# EAGLE schematic Arduino Ibus (EAGLE 6.5.0)
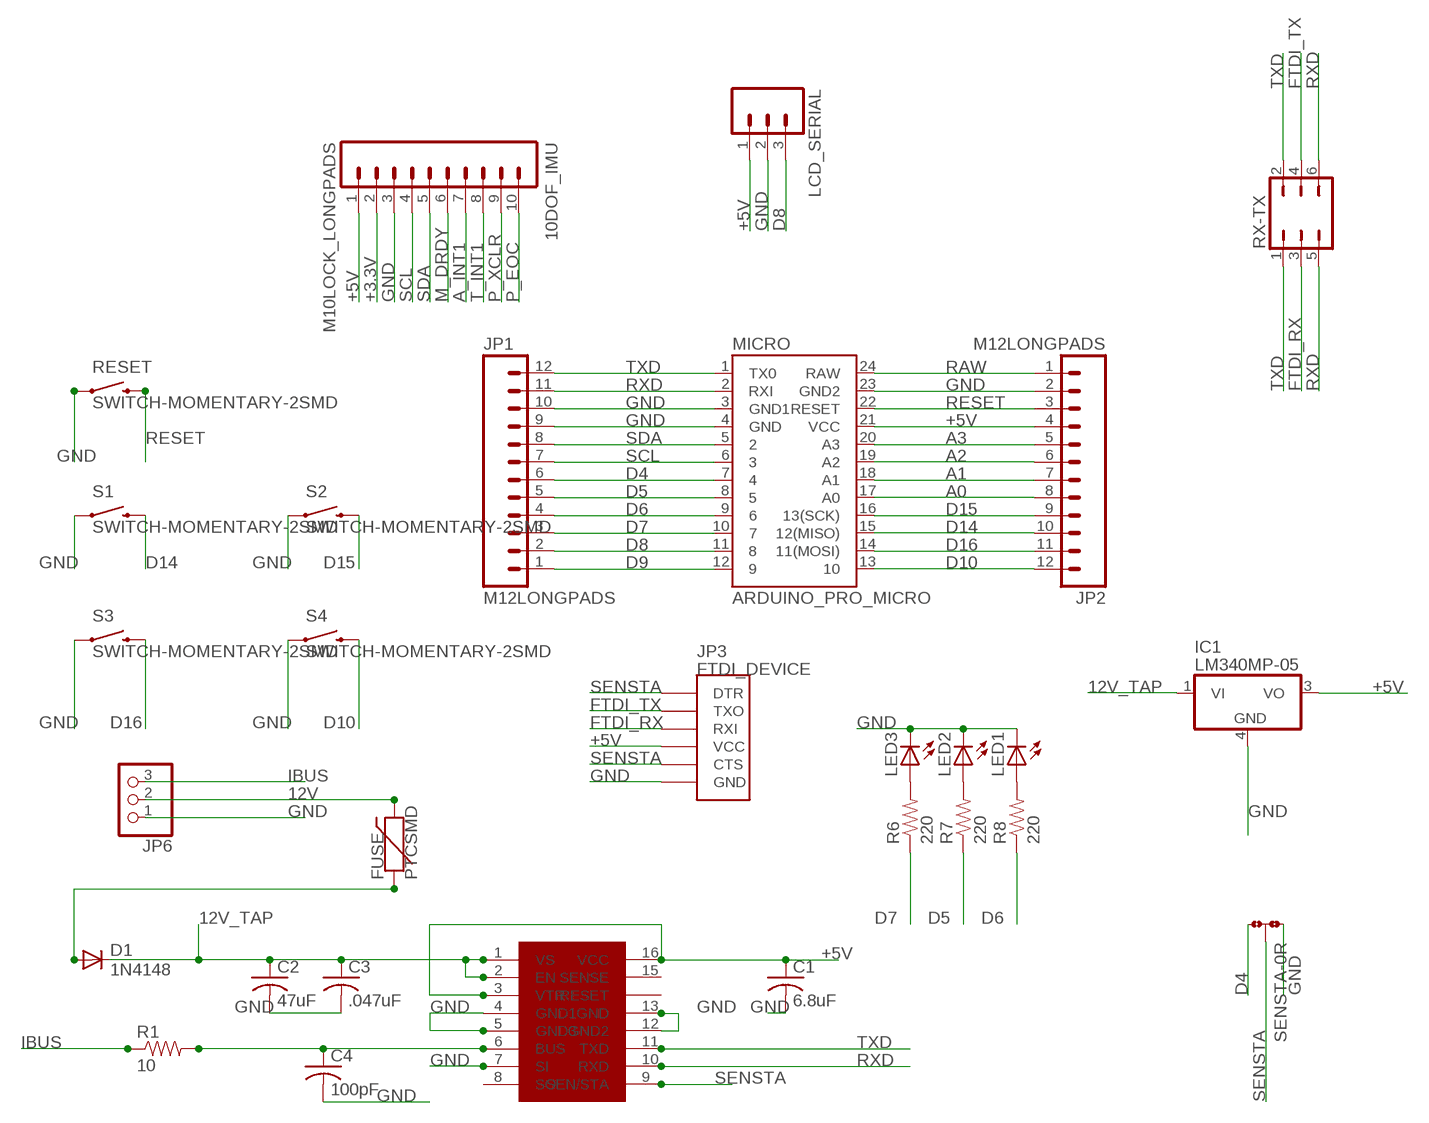
[diagram p0: schematic, sheet 1]

## Parts
10DOF_IMU  M10LOCK_LONGPADS  [1X10_LOCK_LONGPADS]
C1  6.8uF  C-USC1206  [C1206]
C2  47uF  C-USC1206  [C1206]
C3  .047uF  C-USC1206  [C1206]
C4  100pF  C-USC1206  [C1206]
D1  1N4148  DIODESMA  [SMA-DIODE]
FUSE  PTCSMD  [PTC-1206]
IC1  LM340MP-05  [SOT223]
JP1  M12LONGPADS  [1X12_LONGPADS]
JP2  M12LONGPADS  [1X12_LONGPADS]
JP3  FTDI_DEVICE  [FTDI_DEVICE_SIDE]
JP6  PINHD-1X3  [1X03]
LCD_SERIAL  M03LOCK_LONGPADS  [1X03_LOCK_LONGPADS]
LED1  LED1206  [LED-1206]
LED2  LED1206  [LED-1206]
LED3  LED1206  [LED-1206]
MICRO  ARDUINO_PRO_MICRO  [ARDUINO_PRO_MICRO]
R1  10  RESISTOR1206  [1206]
R6  220  RESISTOR1206  [1206]
R7  220  RESISTOR1206  [1206]
R8  220  RESISTOR1206  [1206]
RESET  SWITCH-MOMENTARY-2SMD  [TACTILE_SWITCH_SMD]
RX-TX  JP3Q  [JP3Q]
S1  SWITCH-MOMENTARY-2SMD  [TACTILE_SWITCH_SMD]
S2  SWITCH-MOMENTARY-2SMD  [TACTILE_SWITCH_SMD]
S3  SWITCH-MOMENTARY-2SMD  [TACTILE_SWITCH_SMD]
S4  SWITCH-MOMENTARY-2SMD  [TACTILE_SWITCH_SMD]
SENSTA  0R-JUMPB  [B0R-JMP]
U$1  TH3122  [SO16W]

## Nets
12V [POWER]: FUSE.2 JP6.2
12V_TAP [POWER]: C2.1 C3.1 D1.C IC1.1(VI) U$1.1(VS) U$1.2(EN)
+3.3V: 10DOF_IMU.2
+5V [POWER]: 10DOF_IMU.1 C1.1 IC1.3(VO) JP2.4 JP3.P$4(VCC) LCD_SERIAL.1 MICRO.21(VCC) U$1.3(VTR) U$1.16(VCC)
+12V [POWER]: D1.A FUSE.1
A0: JP2.8 MICRO.17(A0)
A1: JP2.7 MICRO.18(A1)
A2: JP2.6 MICRO.19(A2)
A3: JP2.5 MICRO.20(A3)
A_INT1: 10DOF_IMU.7
D4: JP1.6 MICRO.7 SENSTA.3
D5: JP1.5 MICRO.8 R7.1
D6: JP1.4 MICRO.9 R8.1
D7: JP1.3 MICRO.10 R6.1
D8: JP1.2 LCD_SERIAL.3 MICRO.11
D9: JP1.1 MICRO.12
D10: JP2.12 MICRO.13 S4.3
D14: JP2.10 MICRO.15(12(MISO)) S1.3
D15: JP2.9 MICRO.16(13(SCK)) S2.3
D16: JP2.11 MICRO.14(11(MOSI)) S3.3
FTDI_RX: JP3.P$3(RXI) RX-TX.3
FTDI_TX: JP3.P$2(TXO) RX-TX.4
GND [GND]: 10DOF_IMU.3 C1.2 C2.2 C3.2 C4.2 IC1.4(GND) JP1.9 JP1.10 JP2.2 JP3.P$6(GND) JP6.1 LCD_SERIAL.2 LED1.C LED2.C LED3.C MICRO.3(GND1) MICRO.4(GND) MICRO.23(GND2) RESET.1 S1.1 S2.1 S3.1 S4.1 SENSTA.1 U$1.4(GND1) U$1.5(GND3) U$1.7(SI) U$1.12(GND2) U$1.13(GND)
IBUS: JP6.3 R1.1
M_DRDY: 10DOF_IMU.6
N$1: LED1.A R8.2
N$2: LED2.A R7.2
N$4: C4.1 R1.2 U$1.6(BUS)
N$5: LED3.A R6.2
P_EOC: 10DOF_IMU.10
P_XCLR: 10DOF_IMU.9
RAW: JP2.1 MICRO.24(RAW)
RESET: JP2.3 MICRO.22(RESET) RESET.3
RXD: JP1.11 MICRO.2(RXI) RX-TX.5 RX-TX.6 U$1.10(RXD)
SCL: 10DOF_IMU.4 JP1.7 MICRO.6
SDA: 10DOF_IMU.5 JP1.8 MICRO.5
SENSTA: JP3.P$1(DTR) JP3.P$5(CTS) SENSTA.2 U$1.9(SEN/STA)
T_INT1: 10DOF_IMU.8
TXD: JP1.12 MICRO.1(TX0) RX-TX.1 RX-TX.2 U$1.11(TXD)
Unconnected: U$1.8(SO) U$1.14(RESET) U$1.15(SENSE)

## Library data of the parts
10DOF_IMU = SparkFun-Connectors:M10: Header 10 Standard 10-pin 0.1" header. Use with straight break away headers (SKU : PRT-00116), right angle break away headers (PRT-00553), swiss pins (PRT-00743), machine pins (PRT-00117), and female headers (PRT-00115).
C1-C4 = resistor:C-US: CAPACITOR, American symbol
D1 = SparkFun-DiscreteSemi:DIODE: Diode These are standard reverse protection diodes and small signal diodes. SMA package can handle up to about 1A. SOD-323 can handle about 200mA. What the SOD-323 package when ordering, there are some mfgs out there that are 5-pin packages.
FUSE = SparkFun-PowerIC:PTC: Resettable Fuse PTC Resettable Fuse. Spark Fun Electronics SKU : COM-08357; PROD_ID: RES-11150
IC1 = linear:LM340?-*: Positive VOLTAGE REGULATOR Source: http://cache.national.com/ds/LM/LM340.pdf
JP1 JP2 = SparkFun-Connectors:M12: Header 12 Standard 12-pin 0.1" header. Use with straight break away headers (SKU : PRT-00116), right angle break away headers (PRT-00553), swiss pins (PRT-00743), machine pins (PRT-00117), and female headers (PRT-00115).
JP3 = SparkFun-Connectors:FTDI_DEVICE: Connector which mates to FTDI basic or FTDI cable.
JP6 = pinhead:PINHD-1X3: PIN HEADER
LCD_SERIAL = SparkFun-Connectors:M03: Header 3 Standard 3-pin 0.1" header. Use with straight break away headers (SKU : PRT-00116), right angle break away headers (PRT-00553), swiss pins (PRT-00743), machine pins (PRT-00117), and female headers (PRT-00115). Molex polarized connector foot print use with SKU : PRT-08232 with associated crimp pins and housings.
LED1-LED3 = SparkFun-LED:LED: LEDs Standard schematic elements and footprints for 5mm, 3mm, 1206, and 0603 sized LEDs. 5mm - Spark Fun Electronics SKU : COM-00529 (and others)
MICRO = SparkFun-Boards:ARDUINO_PRO_MICRO
R1 R6-R8 = SparkFun-Passives:RESISTOR: Resistor Basic schematic elements and footprints for 0603, 1206, and PTH resistors.
RESET S1-S4 = SparkFun-Electromechanical:SWITCH-MOMENTARY-2: Various NO switches- pushbuttons, reed, etc
RX-TX = jumper:JP3Q: JUMPER
SENSTA = jump-0r-smd:0R-JUMP: SMD 0R 0805 Jumper
U$1 = Melexisth3122:TH3122

## Net classes
0 default: width 0.254 mm, drill 0.508 mm, clearance 0.254 mm
1 GND: width 0.254 mm, drill 0.508 mm, clearance 0.254 mm
2 POWER: width 0.381 mm, drill 0.508 mm, clearance 0.254 mm